# Altium schematic sheet LCDTFT_FPC40P_RGB_CTP.SchDoc
size A3
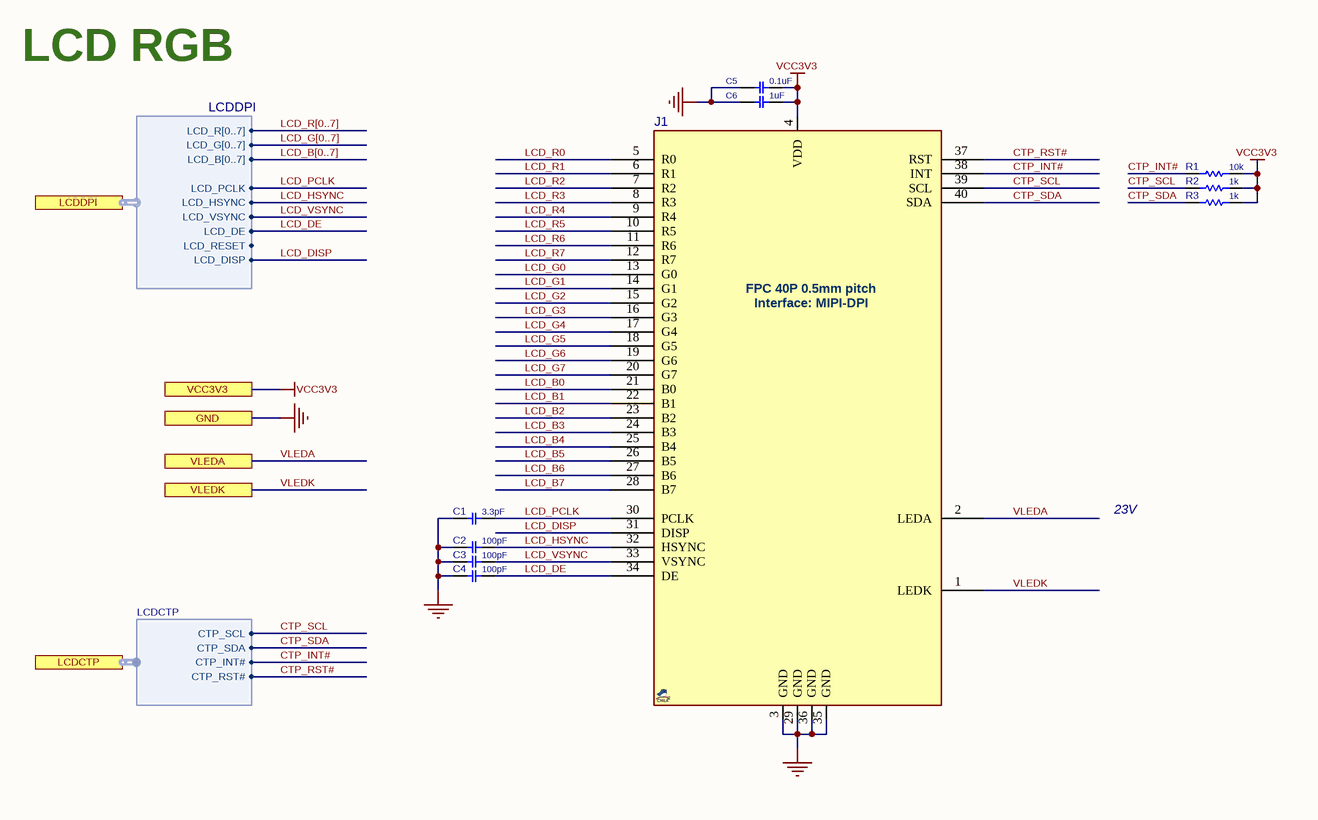
[diagram p0: LCDTFT_FPC40P_RGB_CTP.SchDoc]

## Parts
C1  3.3pF  [C0402]
C2  100pF  [C0402]
C3  100pF  [C0402]
C4  100pF  [C0402]
C5  0.1uF  [C0402]
C6  1uF  [C0402]
J1  FPC_40_0.5mm  [FPC50_40]  (value not drawn)
R1  10k  [R0402]
R2  1k  [R0402]
R3  1k  [R0402]

## Ports
GND, LCDCTP (harness LCDCTP), LCDDPI (harness LCDDPI), VCC3V3, VLEDA, VLEDK

## Harnesses
LCDDPI: LCD_PCLK, LCD_HSYNC, LCD_VSYNC, LCD_DE, LCD_R[0..7], LCD_G[0..7], LCD_B[0..7], LCD_RESET, LCD_DISP
LCDCTP: CTP_SCL, CTP_SDA, CTP_INT#, CTP_RST#

## Nets
GND: C1.2 C2.2 C3.2 C4.2 C5.2 C6.2 J1.3(GND) J1.29(GND) J1.35(GND) J1.36(GND) ; port GND
VCC3V3: C5.1 C6.1 J1.4(VDD) R1.2 R2.2 R3.2 ; port VCC3V3
CTP_INT#: J1.38(INT) R1.1 ; port LCDCTP.CTP_INT#
CTP_RST#: J1.37(RST) ; port LCDCTP.CTP_RST#
CTP_SCL: J1.39(SCL) R2.1 ; port LCDCTP.CTP_SCL
CTP_SDA: J1.40(SDA) R3.1 ; port LCDCTP.CTP_SDA
LCD_B0: J1.21(B0)
LCD_B1: J1.22(B1)
LCD_B2: J1.23(B2)
LCD_B3: J1.24(B3)
LCD_B4: J1.25(B4)
LCD_B5: J1.26(B5)
LCD_B6: J1.27(B6)
LCD_B7: J1.28(B7)
LCD_DE: C4.1 J1.34(DE) ; port LCDDPI.LCD_DE
LCD_DISP: J1.31(DISP) ; port LCDDPI.LCD_DISP
LCD_G0: J1.13(G0)
LCD_G1: J1.14(G1)
LCD_G2: J1.15(G2)
LCD_G3: J1.16(G3)
LCD_G4: J1.17(G4)
LCD_G5: J1.18(G5)
LCD_G6: J1.19(G6)
LCD_G7: J1.20(G7)
LCD_HSYNC: C2.1 J1.32(HSYNC) ; port LCDDPI.LCD_HSYNC
LCD_PCLK: C1.1 J1.30(PCLK) ; port LCDDPI.LCD_PCLK
LCD_R0: J1.5(R0)
LCD_R1: J1.6(R1)
LCD_R2: J1.7(R2)
LCD_R3: J1.8(R3)
LCD_R4: J1.9(R4)
LCD_R5: J1.10(R5)
LCD_R6: J1.11(R6)
LCD_R7: J1.12(R7)
LCD_VSYNC: C3.1 J1.33(VSYNC) ; port LCDDPI.LCD_VSYNC
VLEDA: J1.2(LEDA) ; port VLEDA
VLEDK: J1.1(LEDK) ; port VLEDK

## Buses and harness runs
bus LCD_B[0..7]
bus LCD_G[0..7]
bus LCD_R[0..7]

## Notes on the sheet
- LCD RGB
- 23V
- (in symbol LCDTFT_DPI_FPC40P_RK043FN48H) FPC 40P 0.5mm pitch; Interface: MIPI-DPI

## Library data of the parts
C1-C4 = CAP_SMD_MLCC: CAP, MLCC; PARAM: X5R, 10%; PARAM2: 50v; PRICE: 50,000:	$0.006; MANF_P#: -; MANF: -; ASSEMBLY: ASSEMBLY
  C1: VALUE: 3.3pF
  C2-C4: VALUE: 100pF
C5 = CAP_SMD_MLCC: CAP, MLCC; PARAM: X7R, 10%, -55~125oC; MANF_P#: GRM155R71H104KE14D; MANF: Murata; PARAM2: 50v; PRICE: 100: 0.018$; ASSEMBLY: ASSEMBLY; VALUE: 0.1uF
C6 = CAP_SMD_MLCC: CAP, MLCC; PARAM: X5R, 10%; PRICE: 50,000:	$0.006; MANF_P#: -; MANF: -; PARAM2: -; ASSEMBLY: ASSEMBLY; VALUE: 1uF
J1 = LCDTFT_DPI_FPC40P_RK043FN48H: LCD TFT Color, FPC40P, RGB; MANF: -; MANF_P#: -; PARAM: -; VALUE: FPC_40_0.5mm
R1-R3 = RES_SMD: RESISTOR, SMD; PARAM: 0.063W; DESC: DESCRIPTION; DIST#: MOUSER; PARAM2: 1%; MANF_P#: -; MANF: -; ASSEMBLY: ASSEMBLY; PRICE: 100= 0.3$
  R1: VALUE: 10k
  R2 R3: VALUE: 1k